# EAGLE schematic mother_card_cs_104pm (EAGLE 8.2.2)

## Sheet 1 of 2
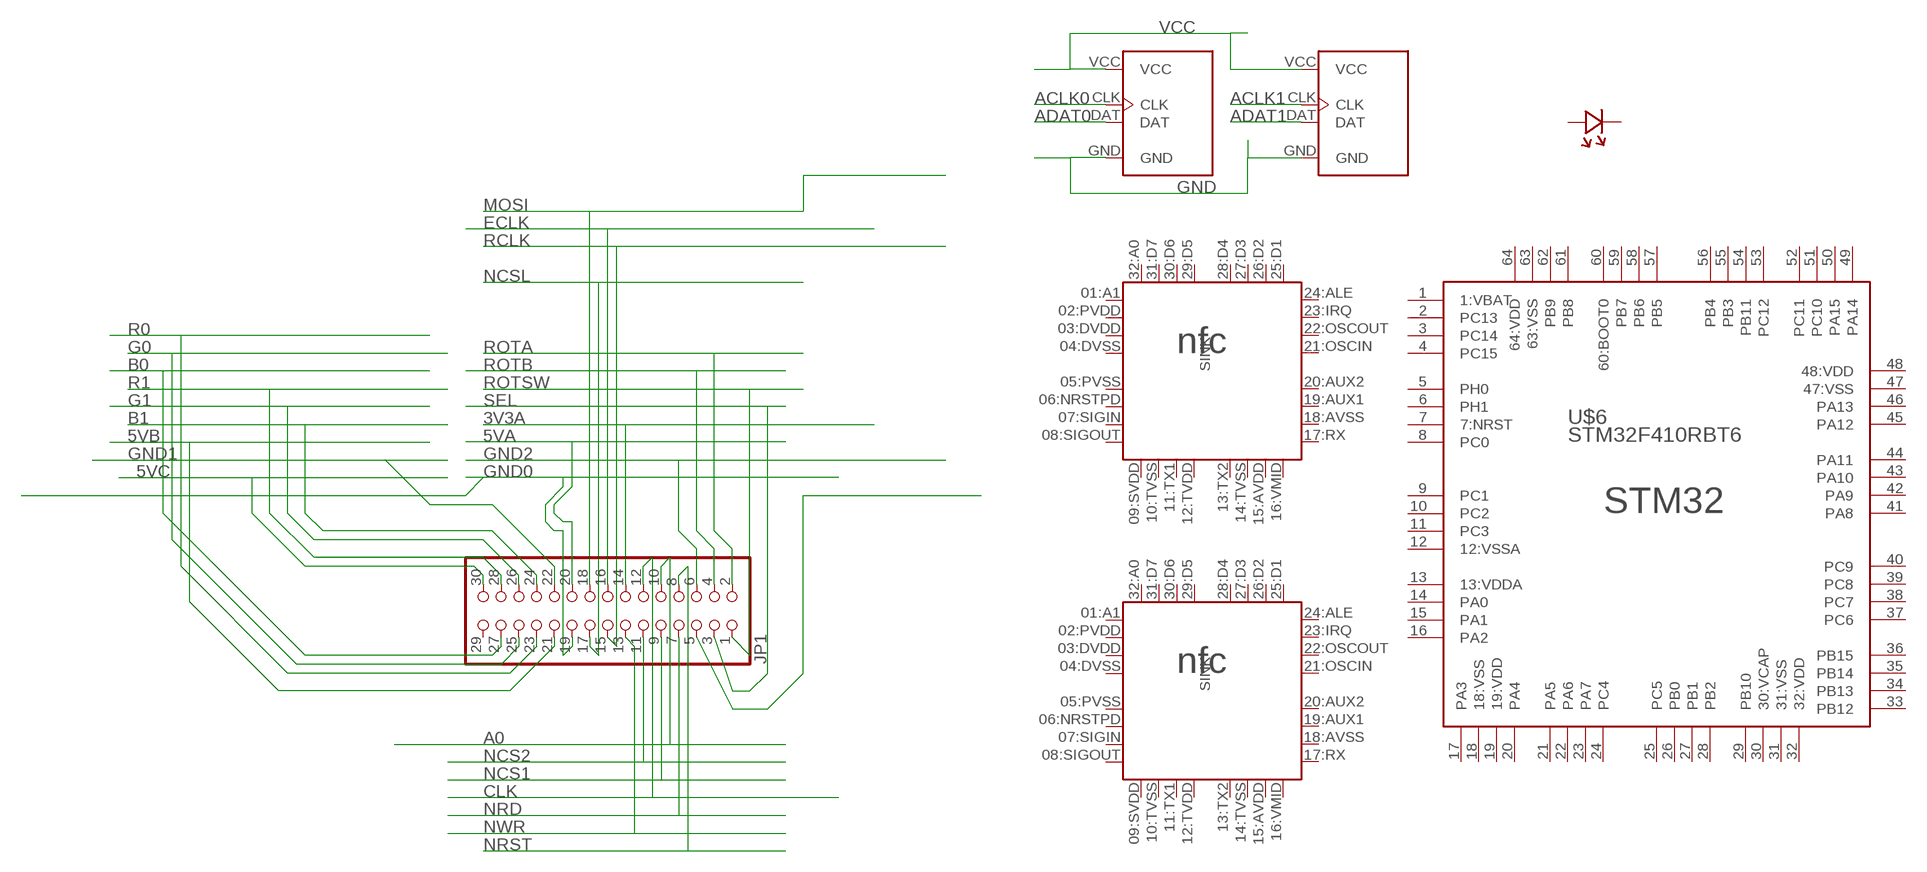
[diagram p0: schematic, sheet 1]

### Parts
JP1  PINHD-2X15/SOCK  [2X15/SOCK]
U$1  HX711  [HX711]
U$2  HX711  [HX711]
U$3  LED0603  [LED]
U$4  PN215_NFC  [PN512_32_5X5]
U$5  PN215_NFC  [PN512_32_5X5]
U$6  STM32F410RBT6  [QFP50P1200X1200X160-64N]

### Nets
3V3A: JP1.14
3V3B: JP1.5
5VA: JP1.20
5VB: JP1.21
5VC: JP1.30
A0: JP1.10
ACLK0: U$1.CLK
ACLK1: U$2.CLK
ADAT0: U$1.DAT
ADAT1: U$2.DAT
B0: JP1.27
B1: JP1.24
CLK: JP1.12
ECLK: JP1.16
G0: JP1.25
G1: JP1.26
GND: U$1.GND U$2.GND
GND0: JP1.19
GND1: JP1.22
GND2: JP1.6
MOSI: JP1.18
NCS1: JP1.9
NCS2: JP1.11
NCSL: JP1.17
NRD: JP1.7
NRST: JP1.8
NWR: JP1.13
R0: JP1.23
R1: JP1.28
RCLK: JP1.15
ROTA: JP1.2
ROTB: JP1.4
ROTSW: JP1.1
SEL: JP1.3
VCC: U$1.VCC U$2.VCC
Unconnected: JP1.29 U$3.ANODE(AN) U$3.CATHODE(CA) U$4.01:A1 U$4.06:NRSTPD U$4.07:SIGIN U$4.08:SIGOUT U$4.11:TX1 U$4.13:TX2 U$4.17:RX U$4.19:AUX1 U$4.20:AUX2 U$4.21:OSCIN U$4.22:OSCOUT U$4.23:IRQ U$4.24:ALE U$4.25:D1 U$4.26:D2 U$4.27:D3 U$4.28:D4 U$4.29:D5 U$4.30:D6 U$4.31:D7 U$4.32:A0 U$5.01:A1 U$5.06:NRSTPD U$5.07:SIGIN U$5.08:SIGOUT U$5.11:TX1 U$5.13:TX2 U$5.17:RX U$5.19:AUX1 U$5.20:AUX2 U$5.21:OSCIN U$5.22:OSCOUT U$5.23:IRQ U$5.24:ALE U$5.25:D1 U$5.26:D2 U$5.27:D3 U$5.28:D4 U$5.29:D5 U$5.30:D6 U$5.31:D7 U$5.32:A0 U$6.1(1:VBAT) U$6.2(PC13) U$6.3(PC14) U$6.4(PC15) U$6.5(PH0) U$6.6(PH1) U$6.7(7:NRST) U$6.8(PC0) U$6.9(PC1) U$6.10(PC2) U$6.11(PC3) U$6.12(12:VSSA) U$6.13(13:VDDA) U$6.14(PA0) U$6.15(PA1) U$6.16(PA2) U$6.17(PA3) U$6.18(18:VSS) U$6.19(19:VDD) U$6.20(PA4) U$6.21(PA5) U$6.22(PA6) U$6.23(PA7) U$6.24(PC4) U$6.25(PC5) U$6.26(PB0) U$6.27(PB1) U$6.28(PB2) U$6.29(PB10) U$6.30(30:VCAP) U$6.31(31:VSS) U$6.32(32:VDD) U$6.33(PB12) U$6.34(PB13) U$6.35(PB14) U$6.36(PB15) U$6.37(PC6) U$6.38(PC7) U$6.39(PC8) U$6.40(PC9) U$6.41(PA8) U$6.42(PA9) U$6.43(PA10) U$6.44(PA11) U$6.45(PA12) U$6.46(PA13) U$6.47(47:VSS) U$6.48(48:VDD) U$6.49(PA14) U$6.50(PA15) U$6.51(PC10) U$6.52(PC11) U$6.53(PC12) U$6.54(PB11) U$6.55(PB3) U$6.56(PB4) U$6.57(PB5) U$6.58(PB6) U$6.59(PB7) U$6.60(60:BOOT0) U$6.61(PB8) U$6.62(PB9) U$6.63(63:VSS) U$6.64(64:VDD)

## Sheet 2 of 2
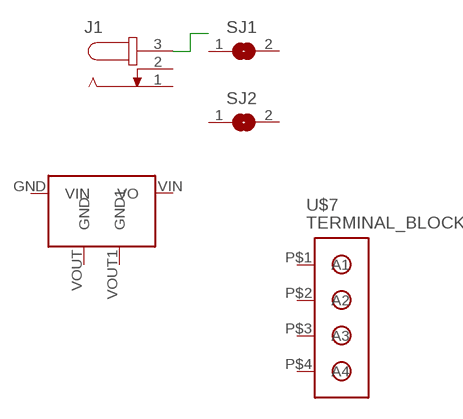
[diagram p1: schematic, sheet 2]

### Parts
J1  JACK-PLUG0  [SPC4077]
SJ1  SJ  [SJ]
SJ2  SJ  [SJ]
U$7  TERMINAL_BLOCK  [1X4/BLOCK]
U$8  AP2114  [AP2114]

### Nets
N$1: J1.3
Unconnected: J1.1 J1.2 SJ1.1 SJ1.2 SJ2.1 SJ2.2 U$7.P$1(A1) U$7.P$2(A2) U$7.P$3(A3) U$7.P$4(A4) U$8.GND(VIN) U$8.VIN(VO) U$8.VOUT1(GND1) U$8.VOUT(GND)

## Power pins joined to a net without a drawn wire
P$2: U$4.02:PVDD U$5.02:PVDD
P$3: U$4.03:DVDD U$5.03:DVDD
P$4: U$4.04:DVSS U$5.04:DVSS
P$5: U$4.05:PVSS U$5.05:PVSS
P$9: U$4.09:SVDD U$5.09:SVDD
P$10: U$4.10:TVSS U$5.10:TVSS
P$12: U$4.12:TVDD U$5.12:TVDD
P$14: U$4.14:TVSS U$5.14:TVSS
P$15: U$4.15:AVDD U$5.15:AVDD
P$16: U$4.16:VMID U$5.16:VMID
P$18: U$4.18:AVSS U$5.18:AVSS
P$33: U$4.SINK U$5.SINK

## Library data of the parts
J1 = con-jack:JACK-PLUG: DC POWER JACK Power Jack, DC, Right Angle, Through Hole, Rated 5A at 16VDC, PC Terminals Distributor: Farnell (www.Farnell.de) Drawing: 84N1161.pdf / 84N1162.pdf Manufacturer: SPC Technology (www.spctechnology.com) Type: SPC4077 / SPC 4078; OC_FARNELL: unknown; OC_NEWARK: unknown
JP1 = csomers:PINHD-2X15: PIN HEADER, socket for parallel cable, IDC connector, On Shore Technology Inc.
SJ1 SJ2 = jumper:SJ: SMD solder JUMPER
U$1 U$2 = seniorDesign:HX711: old green circuit board rendition of HX711 load amplifier
U$3 = seniorDesign:LED0603: Heartbeat LED 0603
U$4 U$5 = seniorDesign:PN215_NFC: NXP USA Inc. PN5120A0HN1/C2,151 nfc chip, mother board https://media.digikey.com/pdf/Data%20Sheets/NXP%20PDFs/PN512.pdf
U$6 = seniorDesign:STM32F410RBT6: STMicroelectronics STM32F410RBT6 main microcontroller, motherboard http://www.st.com/.../content/translations/en.DM00214043.pdf <http://www.st.com/content/ccc/resource/technical/document/datasheet/6e/f3/b0/1b/05/eb/49/fe/DM00214043.pdf/files/DM00214043.pdf/jcr:content/translations/en.DM00214043.pdf>
U$7 = seniorDesign:TERMINAL_BLOCK: Terminal Block for stepper motor connections
U$8 = seniorDesign:AP2114: AP2114H-3.3TRG1DICT-ND 5V LDO, main 5V line, motherboard https://www.diodes.com/assets/Datasheets/AP2114.pdf